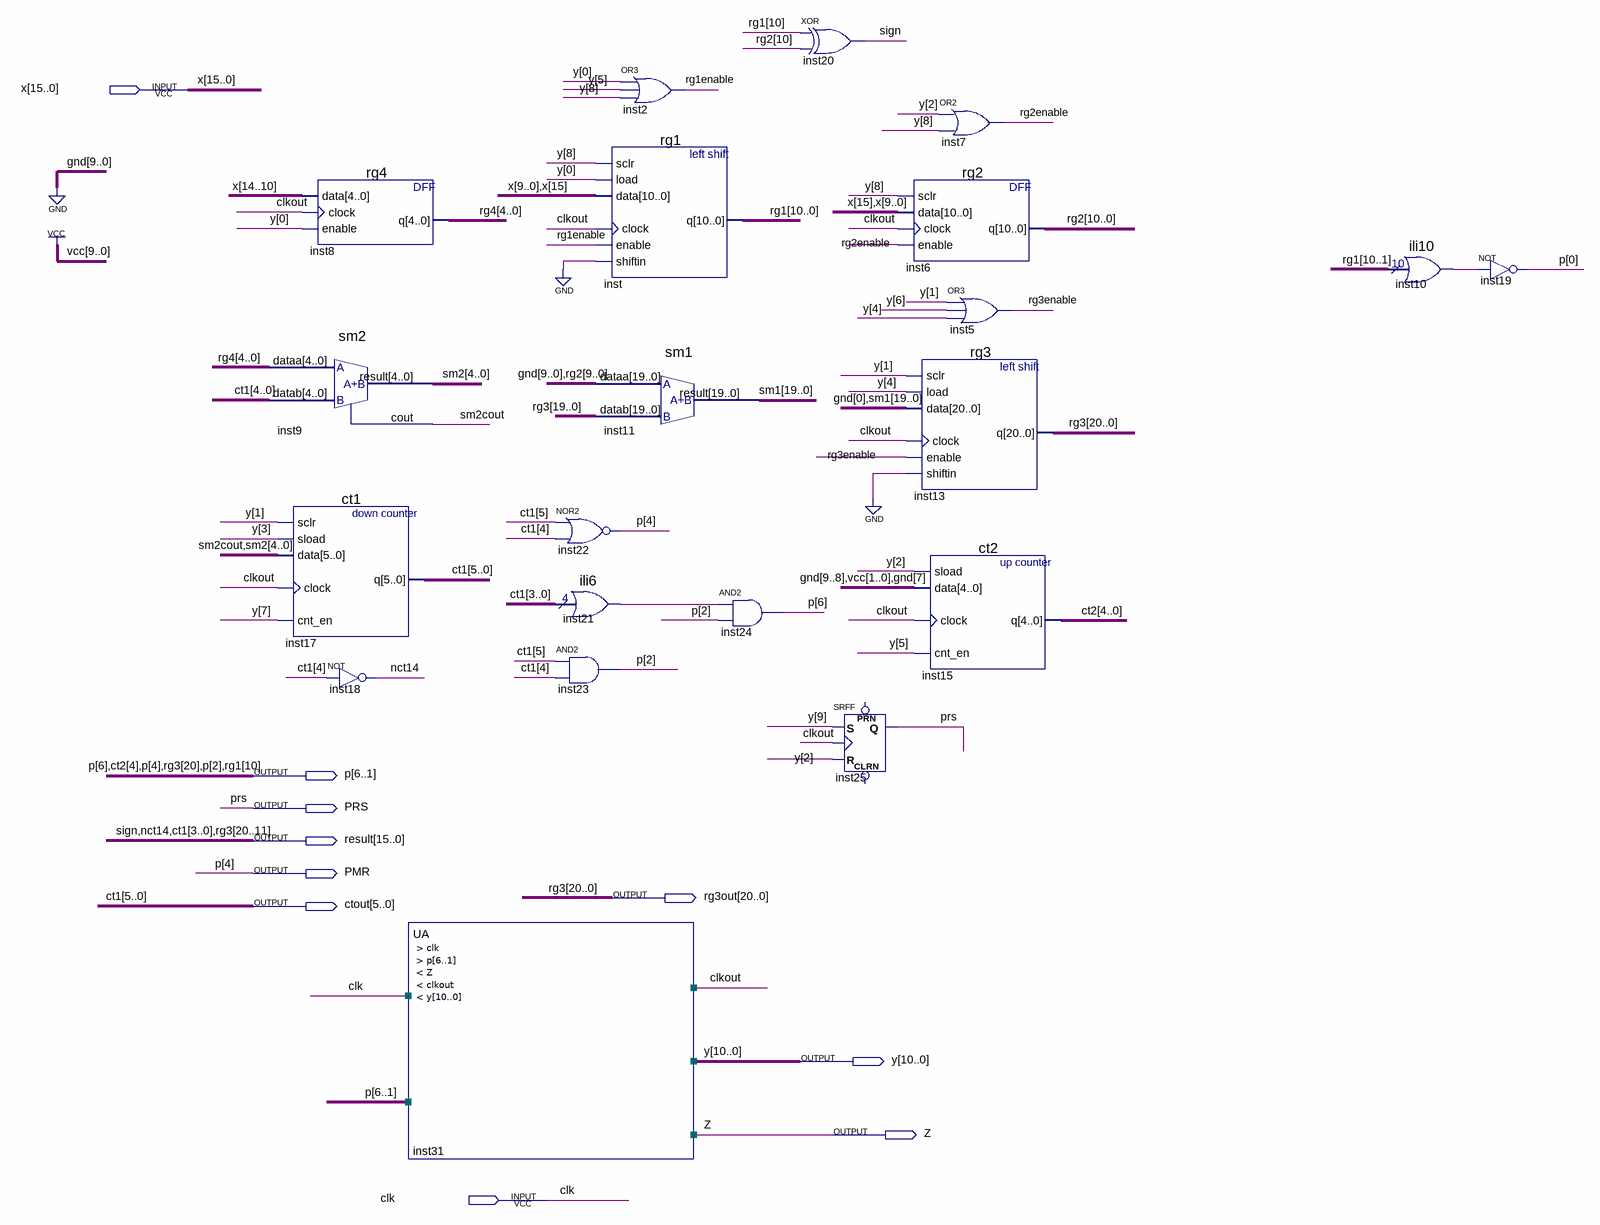
[diagram p0: schematic sheet]
// Quartus schematic KP.bdf as structural Verilog: 21 symbols, 10 pins
module KP (
  input  [15:0] x,
  input  clk,
  output [6:0] p,
  output PRS,
  output [15:0] result,
  output PMR,
  output [20:0] rg3out,
  output [5:0] ctout,
  output [10:0] y,
  output Z
);

  wire clkout, inst10_result, inst21_result, rg1enable, rg2enable, rg3enable, sm2cout;
  wire [3:0] ct2;
  wire [4:0] rg4, sm2;
  wire [9:0] rg1;
  wire [10:0] rg2;
  wire [19:0] sm1;

  sm2 inst9 (.dataa(rg4), .datab(ctout[4:0]), .result(sm2), .cout(sm2cout));
  ct1 inst17 (.sclr(y[1]), .sload(y[3]), .data({sm2cout, sm2}), .clock(clkout), .cnt_en(y[7]), .q(ctout));
  rg4 inst8 (.data(x[14:10]), .clock(clkout), .enable(y[0]), .q(rg4));
  not inst18 (result[14], ctout[4]);
  UA inst31 (.clk(clk), .p(p[6:1]), .Z(Z), .clkout(clkout), .y(y));
  rg1 inst (
    .sclr(y[8]), .load(y[0]), .data({x[9:0], x[15]}), .clock(clkout), .enable(rg1enable), .shiftin(1'b0),
    .q({p[1], rg1}));
  sm1 inst11 (.dataa({{10{1'b0}}, rg2[9:0]}), .datab({result[8:0], rg3out[10:0]}), .result(sm1));
  nor inst22 (p[4], ctout[5], ctout[4]);
  ili6 inst21 (.data(ctout[3:0]), .result(inst21_result));
  and inst23 (p[2], ctout[5], ctout[4]);
  or inst2 (rg1enable, y[0], y[5], y[8]);
  and inst24 (p[6], inst21_result, p[2]);
  xor inst20 (result[15], p[1], rg2[10]);
  SRFF inst25 (.S(y[9]), .R(y[2]), .CLK(clkout), .Q(PRS));  // open: PRN, CLRN
  rg2 inst6 (.sclr(y[8]), .data({x[15], x[9:0]}), .clock(clkout), .enable(rg2enable), .q(rg2));
  rg3 inst13 (
    .sclr(y[1]), .load(y[4]), .data({1'b0, sm1}), .clock(clkout), .enable(rg3enable), .shiftin(1'b0),
    .q({p[3], result[8:0], rg3out[10:0]}));
  ct2 inst15 (.sload(y[2]), .data(5'b00110), .clock(clkout), .cnt_en(y[5]), .q({p[5], ct2}));
  or inst7 (rg2enable, y[2], y[8]);
  or inst5 (rg3enable, y[1], y[6], y[4]);
  ili10 inst10 (.data({p[1], rg1[9:1]}), .result(inst10_result));
  not inst19 (p[0], inst10_result);

  assign PMR = p[4];
  assign result[13:9] = {ctout[3:0], p[3]};
  assign rg3out[20:11] = {p[3], result[8:0]};

  // Other names for the same wires on the sheet: ct1[5:0] = ctout; ct2[4] = p[5]; nct14 = result[14]; rg1[10] = p[1];
  //   rg3[20:0] = {p[3], result[8:0], rg3out[10:0]}; sign = result[15]
endmodule
